# Altium project wzmacniacz_pomiarowy.PrjPcb
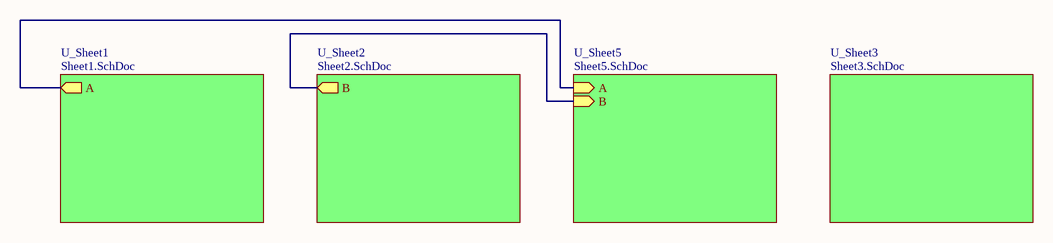
[diagram p0: Sheet4.SchDoc]
5 sheets, 44 parts. Net scope: hierarchical (ports join the sheet entries above them; power ports are global).
Board file: PCB1.PcbDoc
Sheets:
  Sheet4.SchDoc
    U_Sheet1 = Sheet1.SchDoc
    U_Sheet2 = Sheet2.SchDoc
    U_Sheet3 = Sheet3.SchDoc
    U_Sheet5 = Sheet5.SchDoc

## Sheet Sheet4.SchDoc
size A4; SheetNumber: 1; SheetTotal: 5

### Sub-sheets
U_Sheet1 = Sheet1.SchDoc: A (out)
U_Sheet2 = Sheet2.SchDoc: B (out)
U_Sheet3 = Sheet3.SchDoc: no entries
U_Sheet5 = Sheet5.SchDoc: A (in), B (in)

### Nets
Net*1_6: sheet U_Sheet1/A, sheet U_Sheet5/A
NetR8_1: sheet U_Sheet2/B, sheet U_Sheet5/B

## Sheet Sheet1.SchDoc
size A4; SheetNumber: 2; SheetTotal: 5
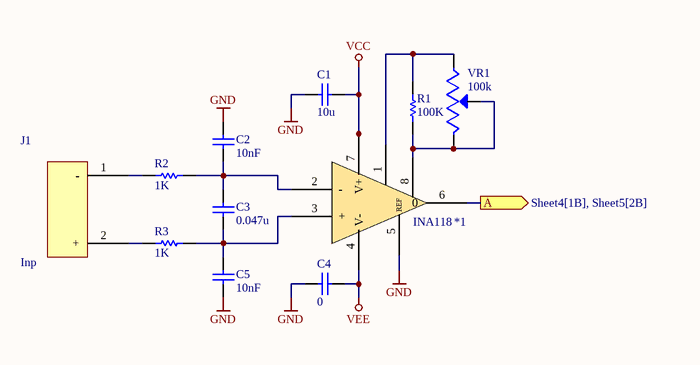
[diagram p1: Sheet1.SchDoc]

### Parts
*1  INA118  [SOIC127P599X175-8N]
C1  value 10u  [CAPC2012X150N]  (hidden comment: Capacitor)
C2  value 10nF  [CAPC2012X150N]  (hidden comment: Capacitor)
C3  value 0.047u  [CAPC2012X150N]  (hidden comment: Capacitor)
C4  value 0  [CAPC2012X150N]  (hidden comment: Capacitor)
C5  value 10nF  [CAPC2012X150N]  (hidden comment: Capacitor)
J1  Inp  [JST_B2B-XH-A_(LF)(SN)]
R1  value 100K  [RES_ERA6AHD330V]  (hidden comment: Resistor)
R2  value 1K  [RES_ERA6AHD330V]  (hidden comment: Resistor)
R3  value 1K  [RES_ERA6AHD330V]  (hidden comment: Resistor)
VR1  100k  [TRIM_3296W-1-103RLF]

### Ports
A (out, see Sheet4[1B], Sheet5[2B])

### Nets
GND: *1.5(REF) C1.2 C2.2 C4.2 C5.1
VCC: *1.7(V+) C1.1
VEE: *1.4(V-) C4.1
Net*1_1: *1.1 R1.2 VR1.1(CCW)
Net*1_2: *1.2(-) C2.1 C3.2 R2.2
Net*1_3: *1.3(+) C3.1 C5.2 R3.2
Net*1_6: *1.6(0) ; port A
Net*1_8: *1.8 R1.1 VR1.2(WIPER) VR1.3(CW)
NetJ1_1: J1.1(-) R2.1
NetJ1_2: J1.2(+) R3.1

### Library data of the parts
C1-C5 = Capacitor: SimulationGenericComponent: True
R1-R3 = Resistor: TC1: 0; SimulationGenericComponent: True; TC2: 0
VR1 = 3296W-1-103RLF: Trimmer, Cermet, Rest 10 Kilohms, PCB, 25 Turns, Pwr-Rtg 0.5W | Bourns 3296W-1-103RLF; SnapEDA_Link: https://www.snapeda.com/parts/3296W-1-103RLF/Bourns/view-part/?ref=snap; Package: NON STANDARD-3 Bourns; Value: *; MF: Bourns; MP: 3296W-1-103RLF; Check_prices: https://www.snapeda.com/parts/3296W-1-103RLF/Bourns/view-part/?ref=eda

## Sheet Sheet2.SchDoc
size A4; SheetNumber: 3; SheetTotal: 5
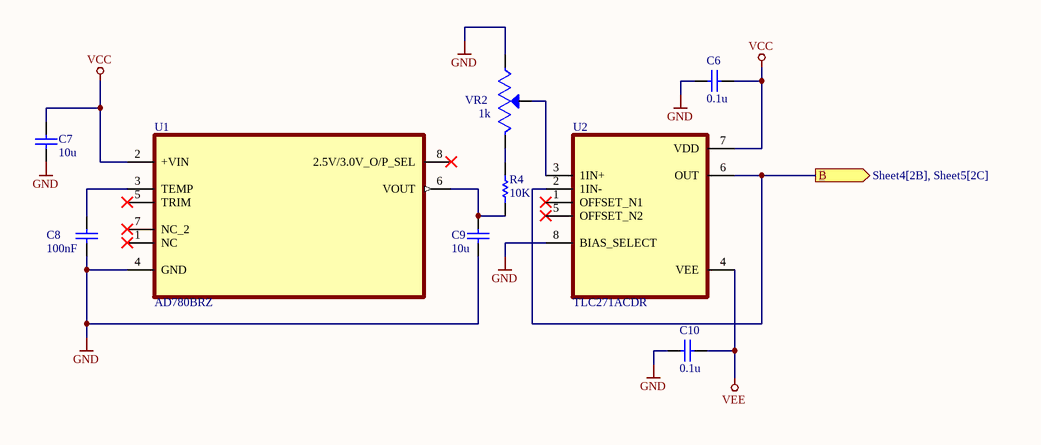
[diagram p2: Sheet2.SchDoc]

### Parts
C6  value 0.1u  [CAPC2012X150N]  (hidden comment: Capacitor)
C7  value 10u  [CAPC2012X150N]  (hidden comment: Capacitor)
C8  value 100nF  [CAPC2012X150N]  (hidden comment: Capacitor)
C9  value 10u  [CAPC2012X150N]  (hidden comment: Capacitor)
C10  value 0.1u  [CAPC2012X150N]  (hidden comment: Capacitor)
R4  value 10K  [RES_ERA6AHD330V]  (hidden comment: Resistor)
U1  AD780BRZ  [SOIC127P600X175-8N]
U2  TLC271ACDR  [SOIC127P599X175-8N]
VR2  1k  [TRIM_3296W-1-103RLF]

### Ports
B (out, see Sheet4[2B], Sheet5[2C])

### Nets
GND: C6.2 C7.1 C8.1 C9.1 C10.2 U1.4(GND) U2.8(BIAS_SELECT) VR2.1(CCW)
VCC: C6.1 C7.2 U1.2(+VIN) U2.7(VDD)
VEE: C10.1 U2.4(VEE)
NetC8_2: C8.2 U1.3(TEMP)
NetC9_2: C9.2 R4.1 U1.6(VOUT)
NetR4_2: R4.2 VR2.3(CW)
NetR8_1: U2.2(1IN-) U2.6(OUT) ; port B
NetU2_3: U2.3(1IN+) VR2.2(WIPER)

Not connected (* = marked no-connect by the designer): U1 1(NC)* 5(TRIM)* 7(NC_2)* 8(2.5V/3.0V_O/P_SEL)*; U2 1(OFFSET_N1)* 5(OFFSET_N2)*

### Library data of the parts
C6-C10 = Capacitor: SimulationGenericComponent: True
R4 = Resistor: TC1: 0; SimulationGenericComponent: True; TC2: 0
U1 = AD780BRZ: 2.5 V/3.0 V High Precision Reference; MF: Analog Devices; SnapEDA_Link: https://www.snapeda.com/parts/AD780BRZ/Analog+Devices/view-part/?ref=snap; Package: SOIC-8 Analog Devices; Value: *; MP: AD780BRZ; Check_prices: https://www.snapeda.com/parts/AD780BRZ/Analog+Devices/view-part/?ref=eda
U2 = TLC271ACDR: Single, 16-V, 2-MHz, 5-mV offset voltage, In to V- operational amplifier; MF: Texas Instruments; SnapEDA_Link: https://www.snapeda.com/parts/TLC271ACDR/Texas+Instruments/view-part/?ref=snap; Package: SOIC-8 Texas Instruments; Value: *; MP: TLC271ACDR; Check_prices: https://www.snapeda.com/parts/TLC271ACDR/Texas+Instruments/view-part/?ref=eda
VR2 = 3296W-1-103RLF: as VR1 on sheet Sheet1; SnapEDA_Link: https://www.snapeda.com/parts/3296W-1-103RLF/Bourns/view-part/?ref=snap; Package: NON STANDARD-3 Bourns; Value: *; MF: Bourns; MP: 3296W-1-103RLF; Check_prices: https://www.snapeda.com/parts/3296W-1-103RLF/Bourns/view-part/?ref=eda

## Sheet Sheet3.SchDoc
size A4; SheetNumber: 4; SheetTotal: 5
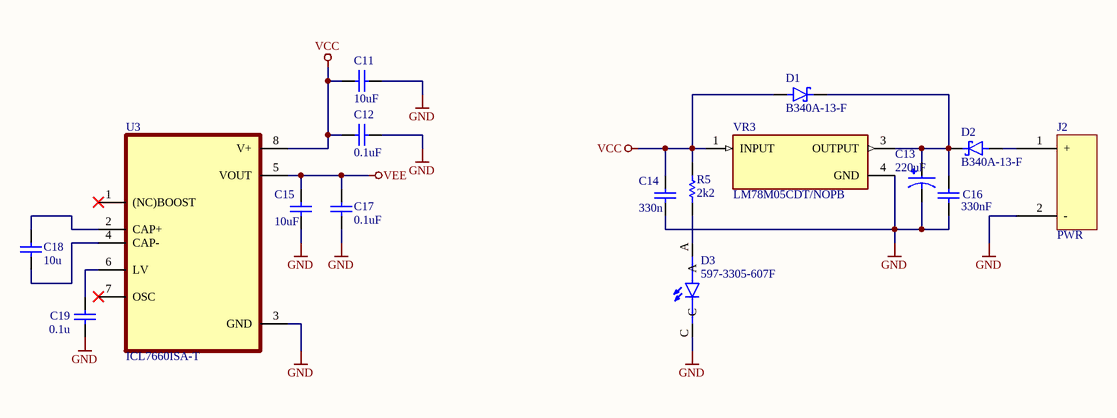
[diagram p3: Sheet3.SchDoc]

### Parts
C11  value 10uF  [CAPC2012X150N]  (hidden comment: Capacitor)
C12  value 0.1uF  [CAPC2012X150N]  (hidden comment: Capacitor)
C13  220uF  [CAP_EEEFT1V331AP]
C14  value 330n  [CAPC2012X150N]  (hidden comment: Capacitor)
C15  value 10uF  [CAPC2012X150N]  (hidden comment: Capacitor)
C16  value 330nF  [CAPC2012X150N]  (hidden comment: Capacitor)
C17  value 0.1uF  [CAPC2012X150N]  (hidden comment: Capacitor)
C18  value 10u  [CAPC2012X150N]  (hidden comment: Capacitor)
C19  value 0.1u  [CAPC2012X150N]  (hidden comment: Capacitor)
D1  B340A-13-F  [DIOM5226X240N]
D2  B340A-13-F  [DIOM5226X240N]
D3  597-3305-607F  [LEDC2012X70N]
J2  PWR  [JST_B2B-XH-A_(LF)(SN)]
R5  value 2k2  [RES_ERA6AHD330V]  (hidden comment: Resistor)
U3  ICL7660ISA-T  [SOIC127P600X175-8N]
VR3  LM78M05CDT/NOPB  [TO228P991X255-3N]

### Nets
GND: C11.2 C12.1 C13.2 C14.2 C15.1 C16.2 C17.1 C19.1 D3.C J2.2(-) U3.3(GND) VR3.4(GND)
VCC: C11.1 C12.2 C14.1 D1.A R5.2 U3.8(V+) VR3.1(INPUT)
VEE: C15.2 C17.2 U3.5(VOUT)
NetC13_1: C13.1 C16.1 D1.C D2.C VR3.3(OUTPUT)
NetC18_1: C18.1 U3.4(CAP-)
NetC18_2: C18.2 U3.2(CAP+)
NetC19_2: C19.2 U3.6(LV)
NetD2_A: D2.A J2.1(+)
NetD3_A: D3.A R5.1

Not connected (* = marked no-connect by the designer): U3 1((NC)BOOST)* 7(OSC)*

### Library data of the parts
C11 C12 C14-C19 = Capacitor: SimulationGenericComponent: True
C13 = EEEFT1V331AP: Capacitor,Alum Electrolytic,Cap 330 uF,Tol 20%,Vol-Rtg 35 VDC,SMT,8x10.2,TR | Panasonic Electronic Components EEE-FT1V331AP; SnapEDA_Link: https://www.snapeda.com/parts/EEE-FT1V331AP/Panasonic/view-part/?ref=snap; Package: RADIAL-2 Panasonic; Value: *; MF: Panasonic Electronic; MP: EEE-FT1V331AP; Check_prices: https://www.snapeda.com/parts/EEE-FT1V331AP/Panasonic/view-part/?ref=eda
D1 D2 = B340A-13-F: Schottky Diode 3A 40V 0.5Vf SMA | Diodes Inc B340A-13-F; MF: Diodes Inc.; SnapEDA_Link: https://www.snapeda.com/parts/B340A-13-F/Diodes+Inc./view-part/?ref=snap; Package: DO-214 Diodes Inc.; Value: *; MP: B340A-13-F; Check_prices: https://www.snapeda.com/parts/B340A-13-F/Diodes+Inc./view-part/?ref=eda
D3 = 597-3305-607F: LED Uni-Color Green 4-Pin Chip 0805 T/R; Availability: Unavailable; Value: *; Price: None; MP: 597-3305-607F; Package: None
J2 = Outp
R5 = Resistor: TC1: 0; SimulationGenericComponent: True; TC2: 0
U3 = ICL7660ISA-T: Switched-Capacitor Voltage Converters; MF: Analog Devices; MP: ICL7660ISA+; SnapEDA_Link: https://www.snapeda.com/parts/ICL7660ISA+/Analog+Devices/view-part/?ref=snap; Package: SOIC-8 Maxim; Value: *; Check_prices: https://www.snapeda.com/parts/ICL7660ISA+/Analog+Devices/view-part/?ref=eda
VR3 = LM78M05CDT/NOPB: 500-mA, 35-V, linear voltage regulator for 5 V; MF: Texas Instruments; SnapEDA_Link: https://www.snapeda.com/parts/LM78M05CDT/NOPB/Texas+Instruments/view-part/?ref=snap; Package: TO-252-3 Texas Instruments; Value: *; MP: LM78M05CDT/NOPB; Check_prices: https://www.snapeda.com/parts/LM78M05CDT/NOPB/Texas+Instruments/view-part/?ref=eda

## Sheet Sheet5.SchDoc
size A4; SheetNumber: 5; SheetTotal: 5
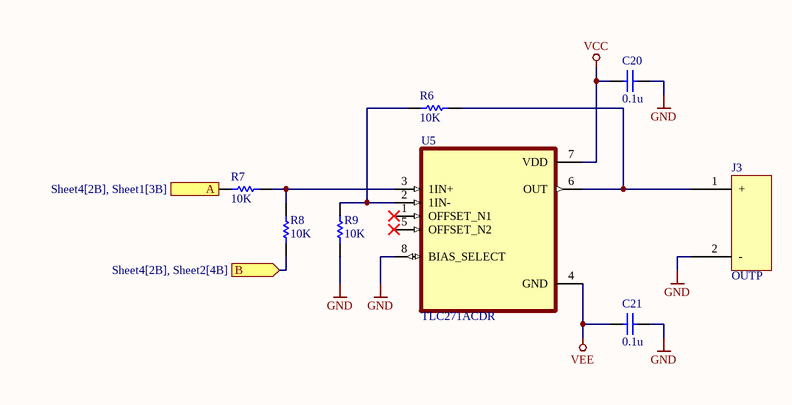
[diagram p4: Sheet5.SchDoc]

### Parts
C20  value 0.1u  [CAPC2012X150N]  (hidden comment: Capacitor)
C21  value 0.1u  [CAPC2012X150N]  (hidden comment: Capacitor)
J3  OUTP  [JST_B2B-XH-A_(LF)(SN)]
R6  value 10K  [RES_ERA6AHD330V]  (hidden comment: Resistor)
R7  value 10K  [RES_ERA6AHD330V]  (hidden comment: Resistor)
R8  value 10K  [RES_ERA6AHD330V]  (hidden comment: Resistor)
R9  value 10K  [RES_ERA6AHD330V]  (hidden comment: Resistor)
U5  TLC271ACDR  [SOIC127P599X175-8N]

### Ports
A (in, see Sheet4[2B], Sheet1[3B]), B (in, see Sheet4[2B], Sheet2[4B])

### Nets
GND: C20.1 C21.1 J3.2(-) R9.1 U5.8(BIAS_SELECT)
VCC: C20.2 U5.7(VDD)
VEE: C21.2 U5.4(GND)
Net*1_6: R7.2 ; port A
NetJ3_1: J3.1(+) R6.2 U5.6(OUT)
NetR6_1: R6.1 R9.2 U5.2(1IN-)
NetR7_1: R7.1 R8.2 U5.3(1IN+)
NetR8_1: R8.1 ; port B

Not connected (* = marked no-connect by the designer): U5 1(OFFSET_N1)* 5(OFFSET_N2)*

### Library data of the parts
C20 C21 = Capacitor: SimulationGenericComponent: True
R6-R9 = Resistor: TC1: 0; SimulationGenericComponent: True; TC2: 0
U5 = TLC271ACDR: as U2 on sheet Sheet2; SnapEDA_Link: https://www.snapeda.com/parts/TLC271ACDR/Texas+Instruments/view-part/?ref=snap; Package: SOIC-8 Texas Instruments; Value: *; MP: TLC271ACDR; Check_prices: https://www.snapeda.com/parts/TLC271ACDR/Texas+Instruments/view-part/?ref=eda

## Nets that join several sheets
GND: Sheet1 (5 pins), Sheet2 (8 pins), Sheet3 (12 pins), Sheet5 (5 pins)
VCC: Sheet1 (*1.7 C1.1), Sheet2 (C6.1 C7.2 U1.2 U2.7), Sheet3 (7 pins), Sheet5 (C20.2 U5.7)
VEE: Sheet1 (*1.4 C4.1), Sheet2 (C10.1 U2.4), Sheet3 (C15.2 C17.2 U3.5), Sheet5 (C21.2 U5.4)
Net*1_6: Sheet1 (*1.6), Sheet5 (R7.2)
NetR8_1: Sheet2 (U2.2 U2.6), Sheet5 (R8.1)